# EAGLE design breakout (EAGLE 8.0.1)
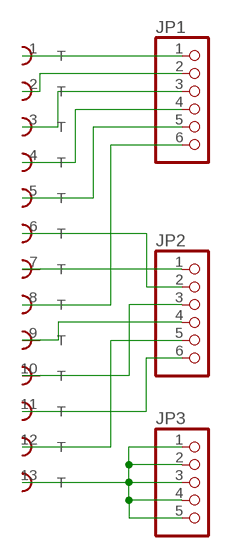
[diagram p0: schematic, sheet 1]

## Parts
J1  DIN13T  [ADADS]
JP1  PINHD-1X6  [1X06]
JP2  PINHD-1X6  [1X06]
JP3  PINHD-1X5  [1X05]

## Nets
GND: J1.13 JP3.1 JP3.2 JP3.3 JP3.4 JP3.5
N$1: J1.1 JP1.1
N$2: J1.2 JP1.2
N$3: J1.3 JP1.3
N$4: J1.4 JP1.4
N$5: J1.5 JP1.5
N$6: J1.7 JP2.1
N$7: J1.6 JP2.2
N$8: J1.8 JP1.6
N$9: J1.10 JP2.3
N$10: J1.11 JP2.6
N$11: J1.9 JP2.4
N$12: J1.12 JP2.5

## Library data of the parts
J1 = ube:DIN13
JP1 JP2 = pinhead:PINHD-1X6: PIN HEADER
JP3 = pinhead:PINHD-1X5: PIN HEADER

## Board
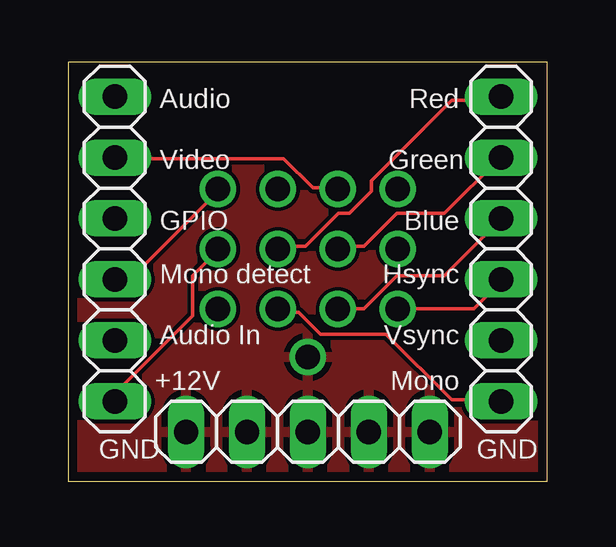
[diagram p1: board, top side]
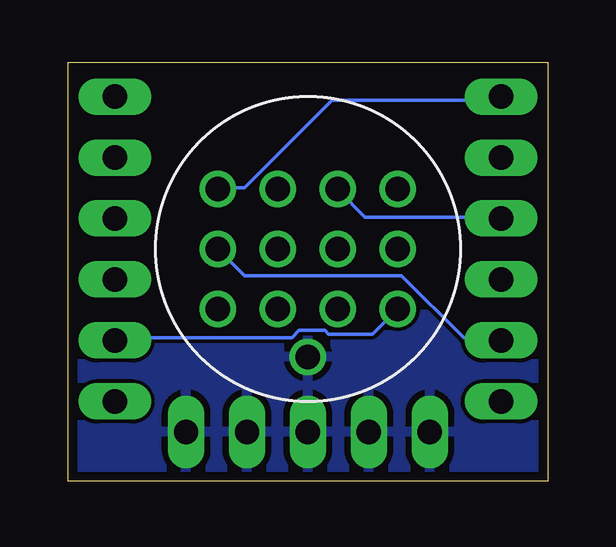
[diagram p2: board, bottom side, seen from below]

Size 19.99 x 17.45 mm. Coordinates in mm from the lower left corner, seen from the top.
Outline: 0,0 19.99,0 19.99,17.45 0,17.45 0,0
Copper layers (1*16): Top 0.0356mm / dielectric 1.5011mm / Bottom 0.0356mm
Design rules "PCBs_io": minimum track width 6mil, minimum drill 13mil, track to track 6mil, track to pad 6mil, pad to pad 6mil, via to via 6mil, smd to smd 6mil, copper to edge 15mil, drill to drill 6mil, minimum pad ring 7mil, minimum via ring 7mil, stop-mask expansion 3mil, vias tented up to drill 0mil, thermal gap 10mil

### Footprints (pad centres in the part's own frame; a part is rotated, then mirrored left to right if it is on the bottom)
ADADS = drill 1.016: 1 -3.75,2.5; 2 -1.25,2.5; 3 1.25,2.5; 4 3.75,2.5; 5 -3.75,0; 6 -1.25,0; 7 1.25,0; 8 3.75,0; 9 -3.75,-2.5; 10 -1.25,-2.5; 11 1.25,-2.5; 12 3.75,-2.5; 13 0,-4.5
1X06 = drill 1.016 long: 1 -6.35,0; 2 -3.81,0; 3 -1.27,0; 4 1.27,0; 5 3.81,0; 6 6.35,0
1X05 = drill 1.016 long: 1 -5.08,0; 2 -2.54,0; 3 0,0; 4 2.54,0; 5 5.08,0

### Placement (x,y rotation side)
J1  10,9.68 0 bottom
JP1  1.95,9.68 270 top
JP2  18.05,9.68 270 top
JP3  10,2.06 0 top

### Tracks (layer width: path | path; a pad name or v marks a point on that pad's centre or on a via)
GND
  pour Bottom: 0,17.46 20.32,17.46 20.32,0 0,0
  pour Top: 0,17.46 20.32,17.46 20.32,0 0,0
N$1
  Bottom 0.152: J1.1 13.72,12.23 12.65,12.23 8.99,15.89 1.98,15.89 JP1.1
N$2
  Top 0.152: J1.2 11.12,12.23 10.21,12.23 8.99,13.45 1.98,13.45 JP1.2
N$3
  Bottom 0.152: JP1.3 1.98,11.01 7.62,11.01 8.69,12.08 J1.3
N$4
  Top 0.152: JP1.4 1.98,8.42 2.59,8.42 6.25,12.08 J1.4
N$5
  Bottom 0.152: JP1.5 1.98,5.98 3.5,5.98 6.1,8.57 12.65,8.57 13.72,9.64 J1.5
N$6
  Top 0.152: J1.7 8.84,9.79 9.91,9.79 11.28,11.16 11.73,11.16 12.65,12.08 12.65,12.53 16,15.89 17.98,15.89 JP2.1
N$7
  Top 0.152: J1.6 11.28,9.79 12.34,9.79 13.72,11.16 15.7,11.16 17.98,13.45 JP2.2
N$8
  Top 0.152: JP1.6 1.98,3.39 1.98,3.7 5.18,6.9 5.18,8.57 6.25,9.64 J1.8
N$9
  Top 0.152: J1.10 11.28,7.2 12.34,7.2 13.72,8.57 15.7,8.57 17.98,10.86 JP2.3
N$10
  Top 0.152: JP2.6 17.98,3.39 16,3.39 13.26,6.13 10.52,6.13 9.6,7.05 8.84,7.05 J1.11
N$11
  Top 0.152: J1.9 13.87,7.2 16.92,7.2 17.98,8.27 JP2.4
N$12
  Bottom 0.152: JP2.5 17.98,5.98 10.67,5.98 10.36,6.29 9.3,6.29 9.14,6.13 7.32,6.13 6.4,7.05 J1.12

### Text on the board
tNames: Audio | Red | Video | Green | GPIO | Blue | Mono detect | Hsync | Audio In | Vsync | +12V | Mono | GND | GND